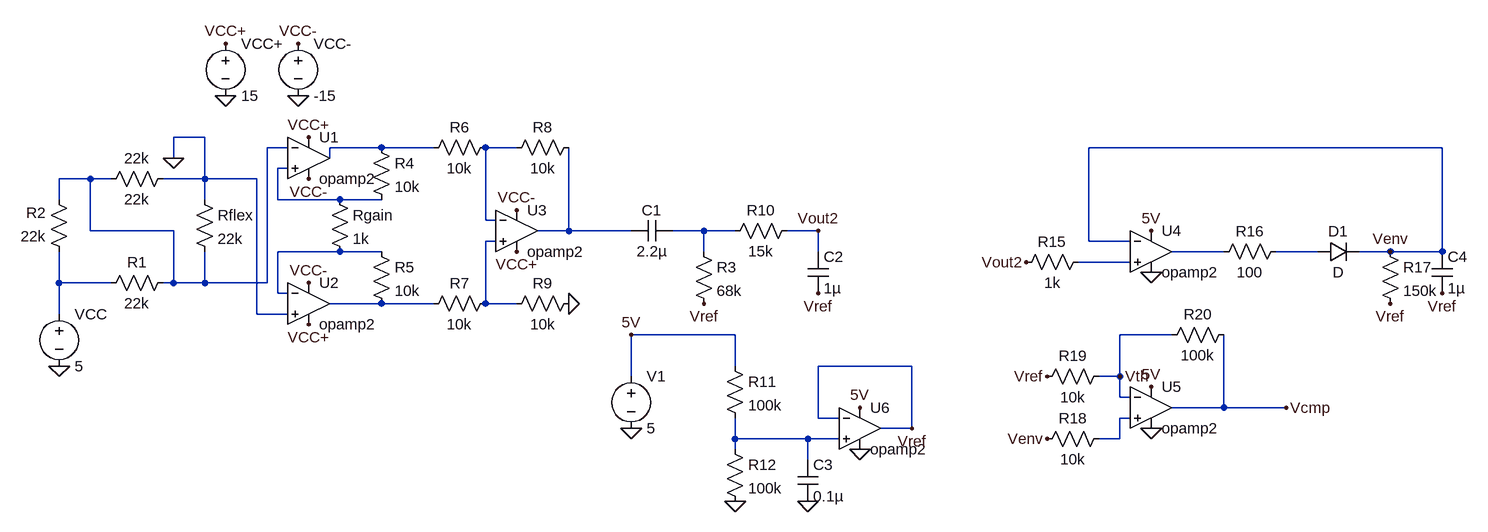
[diagram p0: schematic Smart_Run_Sole.asc]
Smart_Run_Sole.asc, the LTspice schematic file:
Version 4.1
SHEET 1 2232 680
WIRE 272 -128 224 -128
WIRE 400 -112 368 -112
WIRE 544 -112 464 -112
WIRE 624 -112 544 -112
WIRE 752 -112 704 -112
WIRE 2176 -112 1632 -112
WIRE 224 -96 224 -128
WIRE 464 -96 464 -112
WIRE 400 -80 384 -80
WIRE 96 -64 48 -64
WIRE 128 -64 96 -64
WIRE 272 -64 272 -128
WIRE 272 -64 208 -64
WIRE 352 -64 272 -64
WIRE 48 -32 48 -64
WIRE 272 -32 272 -64
WIRE 384 -32 384 -80
WIRE 480 -32 384 -32
WIRE 544 -32 480 -32
WIRE 704 0 704 -112
WIRE 720 0 704 0
WIRE 96 16 96 -64
WIRE 224 16 96 16
WIRE 832 16 832 -112
WIRE 832 16 784 16
WIRE 928 16 832 16
WIRE 1040 16 992 16
WIRE 1088 16 1040 16
WIRE 1216 16 1168 16
WIRE 720 32 704 32
WIRE 1632 32 1632 -112
WIRE 1696 32 1632 32
WIRE 480 48 384 48
WIRE 544 48 480 48
WIRE 1040 48 1040 16
WIRE 1216 48 1216 16
WIRE 1840 48 1760 48
WIRE 1984 48 1920 48
WIRE 2096 48 2048 48
WIRE 2176 48 2176 -112
WIRE 2176 48 2096 48
WIRE 1696 64 1616 64
WIRE 48 96 48 48
WIRE 128 96 48 96
WIRE 224 96 224 16
WIRE 224 96 208 96
WIRE 272 96 272 48
WIRE 272 96 224 96
WIRE 368 96 368 -112
WIRE 368 96 272 96
WIRE 384 112 384 48
WIRE 400 112 384 112
WIRE 544 128 464 128
WIRE 624 128 544 128
WIRE 704 128 704 32
WIRE 752 128 704 128
WIRE 48 144 48 96
WIRE 352 144 352 -64
WIRE 400 144 352 144
WIRE 1088 176 928 176
WIRE 1760 176 1680 176
WIRE 1088 224 1088 176
WIRE 1360 224 1216 224
WIRE 928 240 928 176
WIRE 1680 240 1680 176
WIRE 1680 240 1648 240
WIRE 1680 272 1680 240
WIRE 1696 272 1680 272
WIRE 1840 288 1840 176
WIRE 1840 288 1760 288
WIRE 1936 288 1840 288
WIRE 1216 304 1216 224
WIRE 1248 304 1216 304
WIRE 1696 304 1680 304
WIRE 1360 320 1360 224
WIRE 1360 320 1312 320
WIRE 1088 336 1088 304
WIRE 1200 336 1088 336
WIRE 1248 336 1200 336
WIRE 1680 336 1680 304
WIRE 1680 336 1648 336
WIRE 1088 352 1088 336
WIRE 1200 368 1200 336
FLAG 224 -96 0
FLAG 416 -272 VCC-
FLAG 432 -64 VCC-
FLAG 432 96 VCC-
FLAG 752 -16 VCC-
FLAG 304 -272 VCC+
FLAG 432 -128 VCC+
FLAG 432 160 VCC+
FLAG 752 48 VCC+
FLAG 48 224 0
FLAG 832 128 0
FLAG 304 -192 0
FLAG 416 -192 0
FLAG 1088 432 0
FLAG 928 320 0
FLAG 1200 432 0
FLAG 928 176 5V
FLAG 1216 16 Vout2
FLAG 1040 128 Vref
FLAG 1536 64 Vout2
FLAG 2096 128 Vref
FLAG 2176 112 Vref
FLAG 2096 48 Venv
FLAG 1568 336 Venv
FLAG 1568 240 Vref
FLAG 1936 288 Vcmp
FLAG 1728 320 0
FLAG 1728 16 5V
FLAG 1728 80 0
FLAG 1216 112 Vref
FLAG 1680 240 Vth
FLAG 1360 320 Vref
FLAG 1728 256 5V
FLAG 1280 288 5V
FLAG 1280 352 0
SYMBOL voltage 48 128 R0
WINDOW 123 0 0 Left 0
WINDOW 39 0 0 Left 0
SYMATTR InstName VCC
SYMATTR Value 5
SYMBOL res 224 80 R90
WINDOW 0 0 56 VBottom 2
WINDOW 3 32 56 VTop 2
SYMATTR InstName R1
SYMATTR Value 22k
SYMBOL res 64 64 R180
WINDOW 0 36 76 Left 2
WINDOW 3 36 40 Left 2
SYMATTR InstName R2
SYMATTR Value 22k
SYMBOL res 112 -48 R270
WINDOW 0 32 56 VTop 2
WINDOW 3 0 56 VBottom 2
SYMATTR InstName 22k
SYMATTR Value 22k
SYMBOL res 256 -48 R0
SYMATTR InstName Rflex
SYMATTR Value 22k
SYMBOL res 464 -48 R0
SYMATTR InstName Rgain
SYMATTR Value 1k
SYMBOL res 528 -128 R0
SYMATTR InstName R4
SYMATTR Value 10k
SYMBOL res 528 32 R0
SYMATTR InstName R5
SYMATTR Value 10k
SYMBOL res 720 -128 R90
WINDOW 0 0 56 VBottom 2
WINDOW 3 32 56 VTop 2
SYMATTR InstName R6
SYMATTR Value 10k
SYMBOL res 720 112 R90
WINDOW 0 0 56 VBottom 2
WINDOW 3 32 56 VTop 2
SYMATTR InstName R7
SYMATTR Value 10k
SYMBOL res 848 -128 R90
WINDOW 0 0 56 VBottom 2
WINDOW 3 32 56 VTop 2
SYMATTR InstName R8
SYMATTR Value 10k
SYMBOL res 848 112 R90
WINDOW 0 0 56 VBottom 2
WINDOW 3 32 56 VTop 2
SYMATTR InstName R9
SYMATTR Value 10k
SYMBOL voltage 304 -288 R0
SYMATTR InstName VCC+
SYMATTR Value 15
SYMBOL voltage 416 -288 R0
SYMATTR InstName VCC-
SYMATTR Value -15
SYMBOL OpAmps\\opamp2 432 -160 R0
SYMATTR InstName U1
SYMBOL OpAmps\\opamp2 432 64 R0
SYMATTR InstName U2
SYMBOL OpAmps\\opamp2 752 -48 R0
SYMATTR InstName U3
SYMBOL cap 992 0 R90
WINDOW 0 0 32 VBottom 2
WINDOW 3 32 32 VTop 2
SYMATTR InstName C1
SYMATTR Value 2.2µ
SYMBOL cap 1200 48 R0
SYMATTR InstName C2
SYMATTR Value 1µ
SYMBOL res 1024 32 R0
SYMATTR InstName R3
SYMATTR Value 68k
SYMBOL res 1184 0 R90
WINDOW 0 0 56 VBottom 2
WINDOW 3 32 56 VTop 2
SYMATTR InstName R10
SYMATTR Value 15k
SYMBOL voltage 928 224 R0
SYMATTR InstName V1
SYMATTR Value 5
SYMBOL res 1072 208 R0
SYMATTR InstName R11
SYMATTR Value 100k
SYMBOL res 1072 336 R0
SYMATTR InstName R12
SYMATTR Value 100k
SYMBOL cap 1184 368 R0
SYMATTR InstName C3
SYMATTR Value 0.1µ
SYMBOL OpAmps\\opamp2 1728 -16 R0
SYMATTR InstName U4
SYMBOL res 1632 48 R90
WINDOW 0 0 56 VBottom 2
WINDOW 3 32 56 VTop 2
SYMATTR InstName R15
SYMATTR Value 1k
SYMBOL res 1936 32 R90
WINDOW 0 0 56 VBottom 2
WINDOW 3 32 56 VTop 2
SYMATTR InstName R16
SYMATTR Value 100
SYMBOL diode 1984 64 R270
WINDOW 0 32 32 VTop 2
WINDOW 3 0 32 VBottom 2
SYMATTR InstName D1
SYMBOL res 2080 32 R0
SYMATTR InstName R17
SYMATTR Value 150k
SYMBOL cap 2160 48 R0
SYMATTR InstName C4
SYMATTR Value 1µ
SYMBOL OpAmps\\opamp2 1728 224 R0
SYMATTR InstName U5
SYMBOL res 1664 320 R90
WINDOW 0 0 56 VBottom 2
WINDOW 3 32 56 VTop 2
SYMATTR InstName R18
SYMATTR Value 10k
SYMBOL res 1664 224 R90
WINDOW 0 0 56 VBottom 2
WINDOW 3 32 56 VTop 2
SYMATTR InstName R19
SYMATTR Value 10k
SYMBOL res 1856 160 R90
WINDOW 0 0 56 VBottom 2
WINDOW 3 32 56 VTop 2
SYMATTR InstName R20
SYMATTR Value 100k
SYMBOL OpAmps\\opamp2 1280 256 R0
SYMATTR InstName U6

The netlist it stands for:
* Smart_Run_Sole.asc
VCC N012 0 5
R1 N001 N012 22k
R2 N012 N001 22k
R§22k N001 0 22k
Rflex 0 N001 22k
Rgain N004 N008 1k
R4 N002 N004 10k
R5 N008 N013 10k
R6 N003 N002 10k
R7 N007 N013 10k
R8 N005 N003 10k
R9 0 N007 10k
VCC+ VCC+ 0 15
VCC- VCC- 0 -15
X§U1 N004 N001 VCC+ VCC- N002 opamp2  ; pins In+ In- V+ V- OUT
X§U2 0 N008 VCC- VCC+ N013 opamp2  ; pins In+ In- V+ V- OUT
X§U3 N007 N003 VCC- VCC+ N005 opamp2  ; pins In+ In- V+ V- OUT
C1 N006 N005 2.2µ
C2 Vout2 Vref 1µ
R3 N006 Vref 68k
R10 Vout2 N006 15k
V1 5V 0 5
R11 5V N015 100k
R12 N015 0 100k
C3 N015 0 0.1µ
X§U4 N011 Venv 5V 0 N009 opamp2  ; pins In+ In- V+ V- OUT
R15 N011 Vout2 1k
R16 N010 N009 100
D1 N010 Venv D
R17 Venv Vref 150k
C4 Venv Vref 1µ
X§U5 N014 Vth 5V 0 Vcmp opamp2  ; pins In+ In- V+ V- OUT
R18 N014 Venv 10k
R19 Vth Vref 10k
R20 Vcmp Vth 100k
X§U6 N015 Vref 5V 0 Vref opamp2  ; pins In+ In- V+ V- OUT
.model D D
.lib standard.dio
.backanno
.end